# EAGLE design 6lipo (EAGLE 5.11)
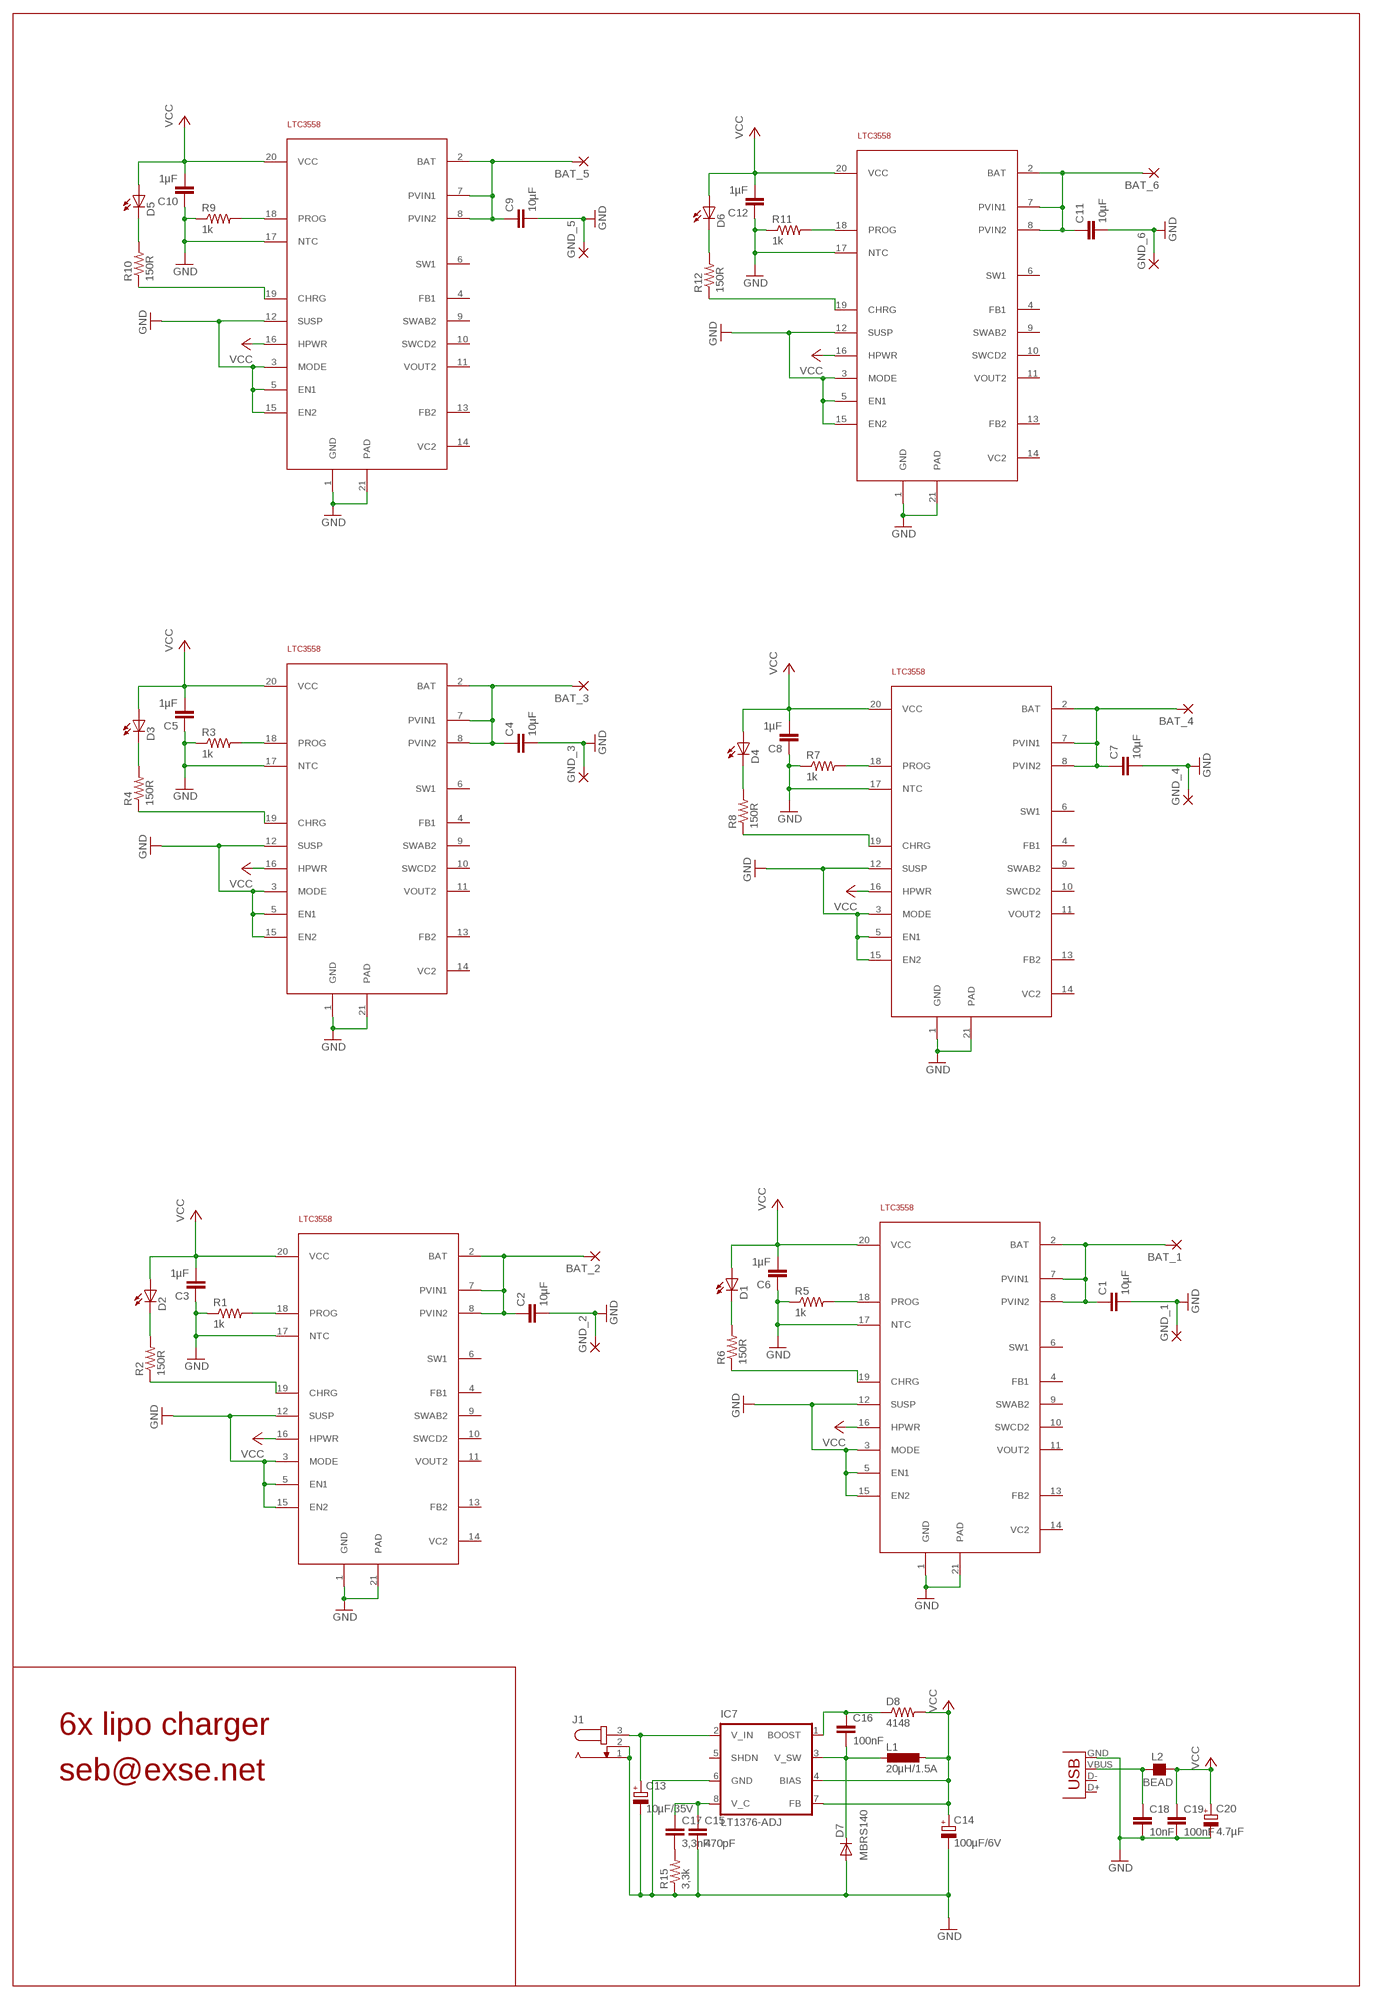
[diagram p0: schematic, sheet 1]

## Parts
BAT_1  SMD5  [SMD2,54-5,08]
BAT_2  SMD5  [SMD2,54-5,08]
BAT_3  SMD5  [SMD2,54-5,08]
BAT_4  SMD5  [SMD2,54-5,08]
BAT_5  SMD5  [SMD2,54-5,08]
BAT_6  SMD5  [SMD2,54-5,08]
C1  10µF  CAP0805  [0805]
C2  10µF  CAP0805  [0805]
C3  1µF  CAP0805  [0805]
C4  10µF  CAP0805  [0805]
C5  1µF  CAP0805  [0805]
C6  1µF  CAP0805  [0805]
C7  10µF  CAP0805  [0805]
C8  1µF  CAP0805  [0805]
C9  10µF  CAP0805  [0805]
C10  1µF  CAP0805  [0805]
C11  10µF  CAP0805  [0805]
C12  1µF  CAP0805  [0805]
C13  10µF/35V  CPOL-EUSMCD  [SMC_D]
C14  100µF/6V  CPOL-EUSMCD  [SMC_D]
C15  470pF  CAP0805  [0805]
C16  100nF  CAP0805  [0805]
C17  3,3nF  CAP0805  [0805]
C18  10nF  CAP0805  [0805]
C19  100nF  CAP0805  [0805]
C20  4.7µF  CPOL-EUSMCC  [SMC_C]
D1  LEDCHIPLED_0805  [CHIPLED_0805]
D2  LEDCHIPLED_0805  [CHIPLED_0805]
D3  LEDCHIPLED_0805  [CHIPLED_0805]
D4  LEDCHIPLED_0805  [CHIPLED_0805]
D5  LEDCHIPLED_0805  [CHIPLED_0805]
D6  LEDCHIPLED_0805  [CHIPLED_0805]
D7  MBRS140  DIODE-SMB  [SMB]
D8  4148  RESISTOR1206  [1206]
GND_1  SMD5  [SMD2,54-5,08]
GND_2  SMD5  [SMD2,54-5,08]
GND_3  SMD5  [SMD2,54-5,08]
GND_4  SMD5  [SMD2,54-5,08]
GND_5  SMD5  [SMD2,54-5,08]
GND_6  SMD5  [SMD2,54-5,08]
IC1  LTC3558  [UD-QFN20]
IC2  LTC3558  [UD-QFN20]
IC3  LTC3558  [UD-QFN20]
IC4  LTC3558  [UD-QFN20]
IC5  LTC3558  [UD-QFN20]
IC6  LTC3558  [UD-QFN20]
IC7  LT1376-ADJ  LT1376  [SO-08]
J1  JACK-PLUG0  [SPC4077]
L1  20µH/1.5A  DO3316P  [DO3316P]
L2  BEAD  FB_0805  [L0805]
R1  1k  RESISTOR  [0805]
R2  150R  RESISTOR  [0805]
R3  1k  RESISTOR  [0805]
R4  150R  RESISTOR  [0805]
R5  1k  RESISTOR  [0805]
R6  150R  RESISTOR  [0805]
R7  1k  RESISTOR  [0805]
R8  150R  RESISTOR  [0805]
R9  1k  RESISTOR  [0805]
R10  150R  RESISTOR  [0805]
R11  1k  RESISTOR  [0805]
R12  150R  RESISTOR  [0805]
R15  3,3k  RESISTOR  [0805]
X1  USB-SMD-NS  [USB-MINIB-NOSTOP]

## Nets
GND: C1.2 C2.2 C3.1 C4.2 C5.1 C6.1 C7.2 C8.1 C9.2 C10.1 C11.2 C12.1 C13.- C14.- C15.2 C18.2 C19.2 C20.- D7.A GND_1.1(P) GND_2.1(P) GND_3.1(P) GND_4.1(P) GND_5.1(P) GND_6.1(P) IC1.1(GND) IC1.3(MODE) IC1.5(EN1) IC1.12(SUSP) IC1.15(EN2) IC1.17(NTC) IC1.21(PAD) IC2.1(GND) IC2.3(MODE) IC2.5(EN1) IC2.12(SUSP) IC2.15(EN2) IC2.17(NTC) IC2.21(PAD) IC3.1(GND) IC3.3(MODE) IC3.5(EN1) IC3.12(SUSP) IC3.15(EN2) IC3.17(NTC) IC3.21(PAD) IC4.1(GND) IC4.3(MODE) IC4.5(EN1) IC4.12(SUSP) IC4.15(EN2) IC4.17(NTC) IC4.21(PAD) IC5.1(GND) IC5.3(MODE) IC5.5(EN1) IC5.12(SUSP) IC5.15(EN2) IC5.17(NTC) IC5.21(PAD) IC6.1(GND) IC6.3(MODE) IC6.5(EN1) IC6.12(SUSP) IC6.15(EN2) IC6.17(NTC) IC6.21(PAD) IC7.6(GND) J1.1 J1.2 R1.1 R3.1 R5.1 R7.1 R9.1 R11.1 R15.1 X1.GND
N$1: BAT_1.1(P) C1.1 IC1.2(BAT) IC1.7(PVIN1) IC1.8(PVIN2)
N$2: D1.C R6.2
N$3: IC1.18(PROG) R5.2
N$4: IC2.18(PROG) R1.2
N$5: IC2.19(CHRG) R2.1
N$6: D2.C R2.2
N$7: BAT_2.1(P) C2.1 IC2.2(BAT) IC2.7(PVIN1) IC2.8(PVIN2)
N$8: IC3.18(PROG) R3.2
N$9: IC3.19(CHRG) R4.1
N$10: IC1.19(CHRG) R6.1
N$11: D3.C R4.2
N$12: BAT_3.1(P) C4.1 IC3.2(BAT) IC3.7(PVIN1) IC3.8(PVIN2)
N$13: IC4.18(PROG) R7.2
N$14: IC4.19(CHRG) R8.1
N$15: D4.C R8.2
N$16: BAT_4.1(P) C7.1 IC4.2(BAT) IC4.7(PVIN1) IC4.8(PVIN2)
N$17: IC5.18(PROG) R9.2
N$18: IC5.19(CHRG) R10.1
N$19: D5.C R10.2
N$20: BAT_5.1(P) C9.1 IC5.2(BAT) IC5.7(PVIN1) IC5.8(PVIN2)
N$21: IC6.18(PROG) R11.2
N$22: IC6.19(CHRG) R12.1
N$23: D6.C R12.2
N$24: BAT_6.1(P) C11.1 IC6.2(BAT) IC6.7(PVIN1) IC6.8(PVIN2)
N$26: C17.2 R15.2
N$27: C13.+ IC7.2(V_IN) J1.3
N$30: C18.1 L2.1 X1.VBUS
N$56: C15.1 C17.1 IC7.8(V_C)
N$57: C16.2 D7.C IC7.3(V_SW) L1.1
N$58: C16.1 D8.1 IC7.1(BOOST)
VCC: C3.2 C5.2 C6.2 C8.2 C10.2 C12.2 C14.+ C19.1 C20.+ D1.A D2.A D3.A D4.A D5.A D6.A D8.2 IC1.16(HPWR) IC1.20(VCC) IC2.16(HPWR) IC2.20(VCC) IC3.16(HPWR) IC3.20(VCC) IC4.16(HPWR) IC4.20(VCC) IC5.16(HPWR) IC5.20(VCC) IC6.16(HPWR) IC6.20(VCC) IC7.4(BIAS) IC7.7(FB) L1.2 L2.2
Unconnected: IC1.4(FB1) IC1.6(SW1) IC1.9(SWAB2) IC1.10(SWCD2) IC1.11(VOUT2) IC1.13(FB2) IC1.14(VC2) IC2.4(FB1) IC2.6(SW1) IC2.9(SWAB2) IC2.10(SWCD2) IC2.11(VOUT2) IC2.13(FB2) IC2.14(VC2) IC3.4(FB1) IC3.6(SW1) IC3.9(SWAB2) IC3.10(SWCD2) IC3.11(VOUT2) IC3.13(FB2) IC3.14(VC2) IC4.4(FB1) IC4.6(SW1) IC4.9(SWAB2) IC4.10(SWCD2) IC4.11(VOUT2) IC4.13(FB2) IC4.14(VC2) IC5.4(FB1) IC5.6(SW1) IC5.9(SWAB2) IC5.10(SWCD2) IC5.11(VOUT2) IC5.13(FB2) IC5.14(VC2) IC6.4(FB1) IC6.6(SW1) IC6.9(SWAB2) IC6.10(SWCD2) IC6.11(VOUT2) IC6.13(FB2) IC6.14(VC2) IC7.5(SHDN) X1.D+ X1.D-

## Notes on the sheet
- 6x lipo charger
- seb@exse.net

## Library data of the parts
BAT_1-BAT_6 GND_1-GND_6 = wirepad:SMD5: SMD PAD
C1-C12 C15-C19 = SparkFun:CAP: Capacitor Standard 0603 ceramic capacitor, and 0.1" leaded capacitor.
C13 C14 C20 = resistor:CPOL-EU: POLARIZED CAPACITOR, European symbol
D1-D6 = led:LED: LED OSRAM: - CHIPLED LG R971, LG N971, LY N971, LG Q971, LY Q971, LO R971, LY R971 LH N974, LH R974 LS Q976, LO Q976, LY Q976 LO Q996 - Hyper CHIPLED LW Q18S LB Q993, LB Q99A, LB R99A - SideLED LS A670, LO A670, LY A670, LG A670, LP A670 LB A673, LV A673, LT A673, LW A673 LH A674 LY A675 LS A676, LA A676, LO A676, LY A676, LW A676 LS A679, LY A679, LG A679 - Hyper Micro SIDELED® LS Y876, LA Y876, LO Y876, LY Y876 LT Y87S - SmartLED LW L88C, LW L88S LB L89C, LB L89S, LG L890 LS L89K, LO L89K, LY L89K LS L896, LA L896, LO L896, LY L896 - TOPLED LS T670, LO T670, LY T670, LG T670, LP T670 LSG T670, LSP T670, LSY T670, LOP T670, LYG T670 LG T671, LOG T671, LSG T671 LB T673, LV T673, LT T673, LW T673 LH T674 LS T676, LA T676, LO T676, LY T676, LB T676, LH T676, LSB T676, LW T676 LB T67C, LV T67C, LT T67C, LS T67K, LO T67K, LY T67K, LW E67C LS E67B, LA E67B, LO E67B, LY E67B, LB E67C, LV E67C, LT E67C LW T67C LS T679, LY T679, LG T679 LS T770, LO T770, LY T770, LG T770, LP T770 LB T773, LV T773, LT T773, LW T773 LH T774 LS E675, LA E675, LY E675, LS T675 LS T776, LA T776, LO T776, LY T776, LB T776 LHGB T686 LT T68C, LB T68C - Hyper Mini TOPLED® LB M676 - Mini TOPLED Santana® LG M470 LS M47K, LO M47K, LY M47K Source: http://www.osram.convergy.de LUXEON: - LUMILED® LXK2-PW12-R00, LXK2-PW12-S00, LXK2-PW14-U00, LXK2-PW14-V00 LXK2-PM12-R00, LXK2-PM12-S00, LXK2-PM14-U00 LXK2-PE12-Q00, LXK2-PE12-R00, LXK2-PE12-S00, LXK2-PE14-T00, LXK2-PE14-U00 LXK2-PB12-K00, LXK2-PB12-L00, LXK2-PB12-M00, LXK2-PB14-N00, LXK2-PB14-P00, LXK2-PB14-Q00 LXK2-PR12-L00, LXK2-PR12-M00, LXK2-PR14-Q00, LXK2-PR14-R00 LXK2-PD12-Q00, LXK2-PD12-R00, LXK2-PD12-S00 LXK2-PH12-R00, LXK2-PH12-S00 LXK2-PL12-P00, LXK2-PL12-Q00, LXK2-PL12-R00 Source: www.luxeon.com KINGBRIGHT: KA-3528ASYC Source: www.kingbright.com
D7 = diode:DIODE-: DIODE
D8 R1-R12 R15 = SparkFun:RESISTOR: Resistor Basic schematic elements and footprints for 0603, 1206, and PTH 1/10th watt (small) resistors.
IC1-IC6 = seb:LTC3558
IC7 = v-reg:LT1376
J1 = con-jack:JACK-PLUG: DC POWER JACK Power Jack, DC, Right Angle, Through Hole, Rated 5A at 16VDC, PC Terminals Distributor: Farnell (www.Farnell.de) Drawing: 84N1161.pdf / 84N1162.pdf Manufacturer: SPC Technology (www.spctechnology.com) Type: SPC4077 / SPC 4078
L1 = inductor-coilcraft:DO3316P: COILCRAFT; OC_FARNELL: unknown; OC_NEWARK: unknown
L2 = rc-master-smd:FB_: FERRITE BEAD
X1 = SparkFun:USB: USB Connectors USB-B-PTH is fully proven SKU : PRT-00139 USB-miniB is fully proven SKU : PRT-00587 USB-A-PCB is untested. USB-A-H is throughly reviewed, but untested. Spark Fun Electronics SKU : PRT-00437 USB-B-SMT is throughly reviewed, but untested. Needs silkscreen touching up. USB-A-S has not been used/tested USB-MB-H has not been used/tested

## Board
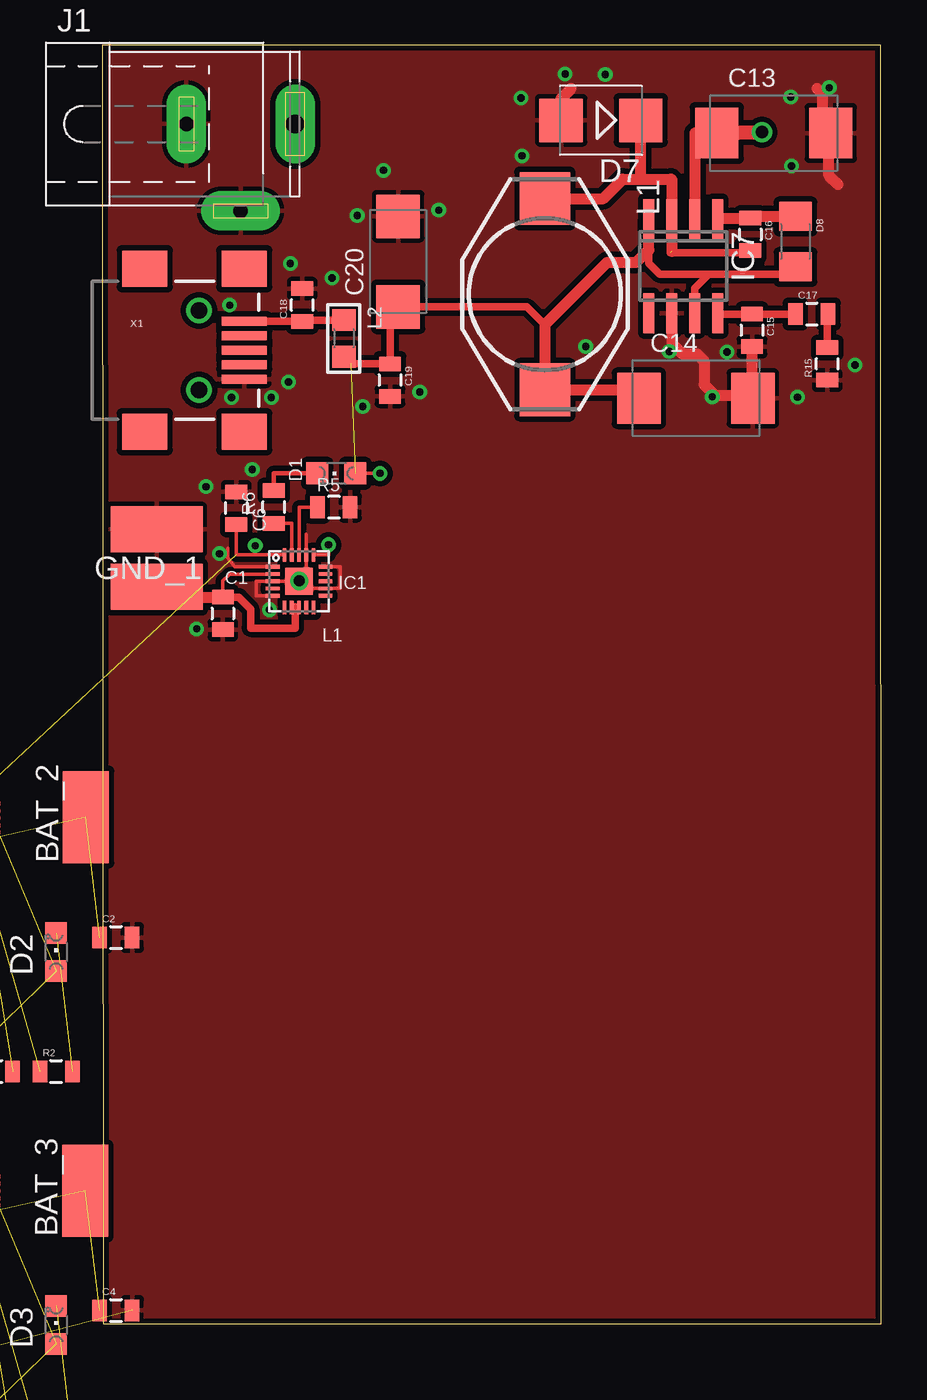
[diagram p1: board, top side]
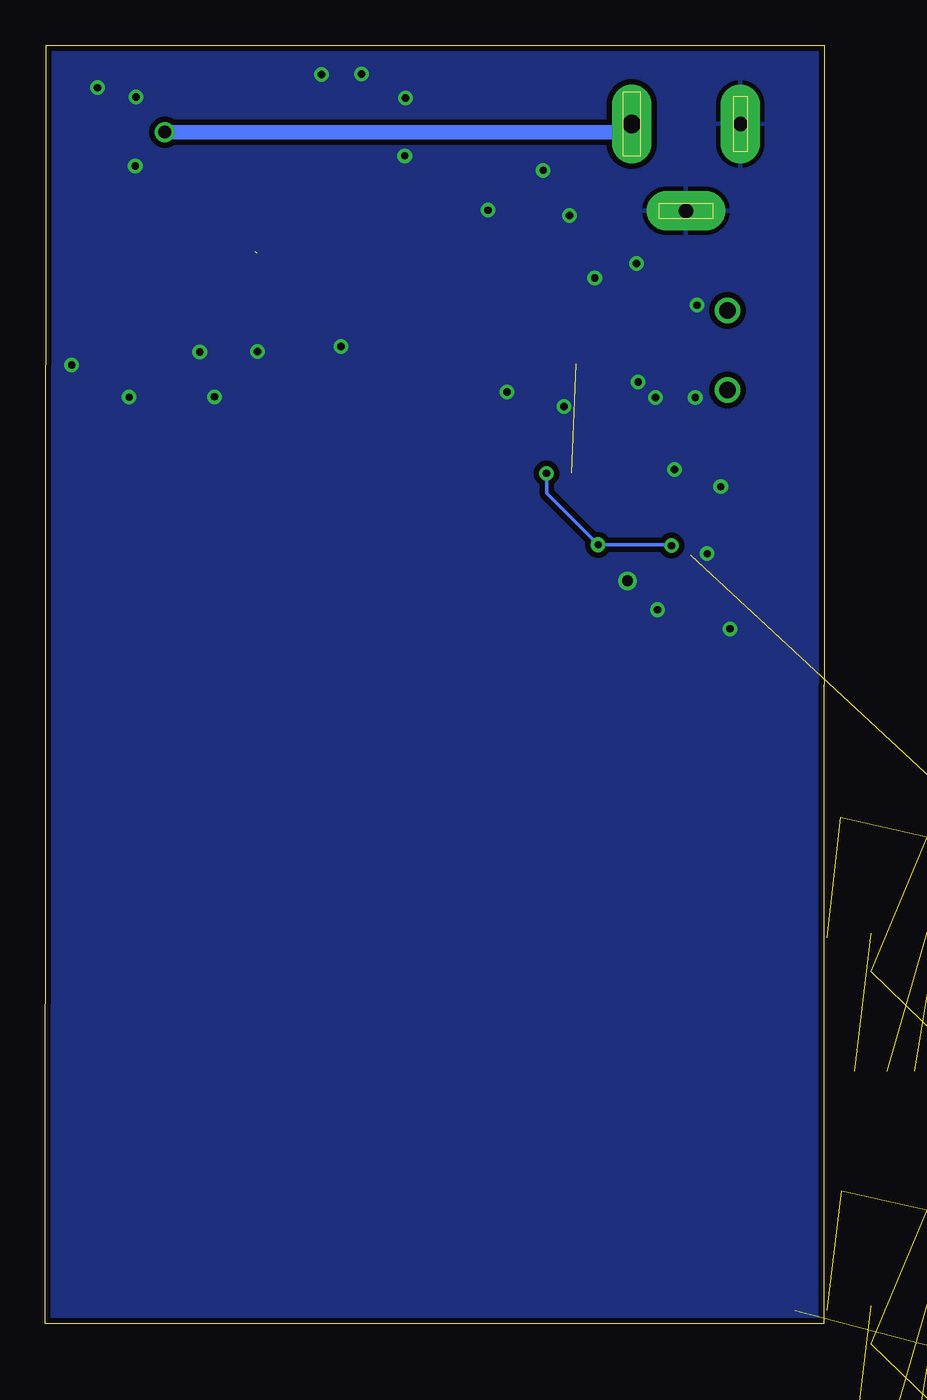
[diagram p2: board, bottom side, seen from below]

Size 43.05 x 70.65 mm. Coordinates in mm from the lower left corner, seen from the top.
Outline: 0.05,0 43.05,0 43,70.65 0,70.65 0.05,0
Copper layers (1*16): Top 0.035mm / dielectric 1.5mm / Bottom 0.035mm
Design rules "default *": minimum track width 0.2mm, minimum drill 0.3mm, track to track 0.2mm, track to pad 0.2mm, pad to pad 0.2mm, via to via 0.2mm, smd to smd 0.2mm, copper to edge 0.2mm, drill to drill 0.2mm, minimum pad ring 10mil, minimum via ring 8mil, stop-mask expansion 4mil, vias tented up to drill 100mil, thermal gap 10mil

### Footprints (pad centres in the part's own frame; a part is rotated, then mirrored left to right if it is on the bottom)
SMD2,54-5,08 = smd 2.54 x 5.08: 1 0,0
0805 = smd 0.8 x 1.2: 1 -0.9,0; 2 0.9,0
SMC_D = smd 2.4 x 2.8: + -3.15,0; - 3.15,0
SMC_C = smd 2.4 x 2.4: + -2.5,0; - 2.5,0
CHIPLED_0805 = smd 1.2 x 1.2: A 0,-1.05; C 0,1.05
SMB = smd 2.4 x 2.4: A 2.2,0; C -2.2,0
1206 = smd 1.6 x 1.8: 1 -1.4,0; 2 1.4,0
UD-QFN20 = smd 0.751 x 0.2: 1 -1.451,0.8; 2 -1.451,0.4; 3 -1.451,0; 4 -1.451,-0.4; 5 -1.451,-0.8; 11 1.451,-0.8; 12 1.451,-0.4; 13 1.451,0; 14 1.451,0.4; 15 1.451,0.8 | smd 0.2 x 0.751: 6 -0.8,-1.451; 7 -0.4,-1.451; 8 0,-1.451; 9 0.4,-1.451; 10 0.8,-1.451; 16 0.8,1.451; 17 0.4,1.451; 18 0,1.451; 19 -0.4,1.451; 20 -0.8,1.451 | smd 1.5 x 1.5: 21 0,0
SO-08 = smd 0.6 x 2.2: 1 -1.905,-2.6; 2 -0.635,-2.6; 3 0.635,-2.6; 4 1.905,-2.6; 5 1.905,2.6; 6 0.635,2.6; 7 -0.635,2.6; 8 -1.905,2.6
SPC4077 = drill 0.8 pad 2.184 long: 1 -3,0; 2 0,-4.8 | drill 1 pad 2.184 long: 3 3,0
DO3316P = smd 2.92 x 2.79: 1 -5.28,0; 2 5.28,0
L0805 = smd 1.2 x 1.3: 1 -1.016,0; 2 1.016,0
USB-MINIB-NOSTOP = smd 2.5 x 0.5: D+ 2.5,0; D- 2.5,0.8; GND 2.5,-1.6; ID 2.5,-0.8; VBUS 2.5,1.6 | smd 2.5 x 2: G1 -3,-4.5; G2 -3,4.5; G3 2.5,4.5; G4 2.5,-4.5 | drill 0.9 pad 0.8 round: H1 0,2.2 | drill 0.9 pad 0.787 round: H2 0,-2.2

### Placement (x,y rotation side)
BAT_1  3.01,40.73 90 top
BAT_2  -0.9,28 0 top
BAT_3  -0.95,7.35 0 top
BAT_4  -0.95,-12.65 0 top  (outside the outline)
BAT_5  -0.95,-32.75 0 top  (outside the outline)
BAT_6  -0.95,-52.8 0 top  (outside the outline)
C1  6.66,39.26 270 top
C2  0.75,21.35 0 top
C3  -9.15,13.95 0 top  (outside the outline)
C4  0.75,0.75 0 top
C5  -9.15,-6.6 0 top  (outside the outline)
C6  7.4,45.08 270 top
C7  0.75,-19.25 0 top  (outside the outline)
C8  -9.15,-26.65 0 top  (outside the outline)
C9  0.75,-39.3 0 top  (outside the outline)
C10  -9.15,-46.7 0 top  (outside the outline)
C11  0.75,-59.35 0 top  (outside the outline)
C12  -9.15,-66.7 0 top  (outside the outline)
C13  37.1,65.8 0 top
C14  32.8,51.15 0 top
C15  35.9,54.9 270 top
C16  35.8,60.2 270 top
C17  39.2,55.8 0 top
C18  11.05,56.3 90 top
C19  15.9,52.15 270 top
C20  16.35,58.7 90 top
D1  12.93,47 90 top
D2  -2.55,20.55 0 top
D3  -2.55,-0.05 0 top
D4  -2.55,-20.05 0 top  (outside the outline)
D5  -2.55,-40.1 0 top  (outside the outline)
D6  -2.55,-60.15 0 top  (outside the outline)
D7  27.55,66.5 180 top
D8  38.3,59.8 270 top
GND_1  3,43.9 90 top
GND_2  -7.5,18.9 0 top  (outside the outline)
GND_3  -7.5,-1.65 0 top  (outside the outline)
GND_4  -7.5,-21.7 0 top  (outside the outline)
GND_5  -7.5,-41.75 0 top  (outside the outline)
GND_6  -7.5,-61.8 0 top  (outside the outline)
IC1  10.87,41.04 0 top
IC2  -7.5,27.95 0 top  (outside the outline)
IC3  -7.5,7.35 0 top  (outside the outline)
IC4  -7.5,-12.65 0 top  (outside the outline)
IC5  -7.5,-32.7 0 top  (outside the outline)
IC6  -7.5,-52.75 0 top  (outside the outline)
IC7  32.1,58.45 180 top
J1  7.65,66.3 0 top
L1  24.45,56.9 270 top
L2  13.35,54.45 270 top
R1  -5.85,13.95 0 top  (outside the outline)
R2  -2.55,13.95 0 top
R3  -5.85,-6.6 0 top  (outside the outline)
R4  -2.55,-6.6 0 top  (outside the outline)
R5  12.79,45.13 180 top
R6  9.47,45.14 90 top
R7  -5.85,-26.65 0 top  (outside the outline)
R8  -2.55,-26.65 0 top  (outside the outline)
R9  -5.85,-46.7 0 top  (outside the outline)
R10  -2.55,-46.7 0 top  (outside the outline)
R11  -5.85,-66.75 0 top  (outside the outline)
R12  -2.55,-66.75 0 top  (outside the outline)
R15  40.05,53.05 90 top
X1  5.35,53.8 0 top

### Tracks (layer width: path | path; a pad name or v marks a point on that pad's centre or on a via)
GND  (via drill 0.4 pad 0.3, 0.6 pad 0.3)  (53 unrouted)
  Top 0.2: IC1.1 7.31,41.84 6.92,42.33 | 6.92,42.33 6.92,42.86 | IC1.21 IC1.3 8.5,41.04 8.5,40.24 IC1.5 | 10.37,40.64 IC1.12 13.15,40.64 13.15,41.84 IC1.15 | 6.92,42.33 6.69,42.56 v6.48,42.56
  Top 0.203: IC1.21 11.27,41.34 IC1.17 11.27,43.63
  Top 0.254: IC1.21 10.37,40.64
  Top 0.61: C15.2 35.9,51.2 C14.- 35.8,51.3 33.85,51.3 33.25,51.9 33.25,53.2 32.85,53.6 32.05,53.6 31.46,54.19 IC7.6 | 40.65,62.95 40.15,63.45 40.15,65.7 C13.- 39.8,66.25 39.8,67.95 39.5,68.25 | D7.A 25.35,67.7 25.9,68.25
  other vias: 40.17,68.31 10.88,41.05 25.58,69.06 33.7,51.23 31.32,53.74 8.29,47.21 38.08,63.98 7.04,56.29 23.19,64.54 26.72,54.01 5.22,38.41 38.42,51.21 34.52,53.71 9.23,39.46 5.73,46.26 23.14,67.74 27.79,69.04 38.04,67.79 41.59,52.99 14.09,61.24 15.54,63.74 18.59,61.54 17.54,51.49 14.39,50.69 12.69,57.79 10.39,58.59 10.29,52.04 7.14,51.19 9.34,51.19
  pour Top (isolate 0.3): 0.05,70.85 43.05,70.85 43.05,-1 0.05,-1
  pour Bottom (isolate 0.3): -0.05,70.75 0.05,-1 43.05,-1 42.95,70.75
N$1
  Top 0.2: IC1.7 10.65,39.64 IC1.8 | IC1.2 7.04,41.44 6.66,41.06 C1.1
  Top 0.254: C1.1 7.08,40.16
  Top 0.406: 10.65,39.64 10.65,38.45 8.2,38.45 8.2,39.5 7.54,40.16 C1.1
  Top 0.61: C1.1 4.72,40.16 3.38,40.16 BAT_1.1
  Top 0.813: 4.8,41.28 4.8,40.16 4.72,40.16
N$2
  Top 0.254: R6.2 9.48,47 D1.C
N$3
  Top 0.2: IC1.18 10.87,45.13 R5.2
N$4  (1 unrouted)
N$5  (1 unrouted)
N$6  (1 unrouted)
N$7  (4 unrouted)
N$8  (1 unrouted)
N$9  (1 unrouted)
N$10
  Top 0.2: IC1.19 10.47,44.24 R6.1
N$11  (1 unrouted)
N$12  (4 unrouted)
N$13  (1 unrouted)
N$14  (1 unrouted)
N$15  (1 unrouted)
N$16  (4 unrouted)
N$17  (1 unrouted)
N$18  (1 unrouted)
N$19  (1 unrouted)
N$20  (4 unrouted)
N$21  (1 unrouted)
N$22  (1 unrouted)
N$23  (1 unrouted)
N$24  (4 unrouted)
N$26
  Top 0.406: C17.2 40.05,55.75 R15.2
N$27  (via drill 0.7)
  Top 0.61: IC7.2 32.73,65.8 C13.+
  Top 0.813: v36.45,65.85 C13.+
  Bottom 0.813: J1.3 11.15,65.85 v36.45,65.85
N$30
  Top 0.406: X1.VBUS C18.1 11.12,55.47 L2.1
N$56
  Top 0.406: IC7.8 34.05,55.8 C15.1 C17.1
N$57  (1 unrouted)
  Top 0.406: C16.2 35.67,59.17 31.38,59.17
  Top 0.61: 31.46,59.27 IC7.3 31.46,63.2 31.41,63.25 29.65,63.25 | L1.1 27.68,62.18 28.75,63.25 29.65,63.25 | D7.C 29.75,63.35 29.65,63.25
N$58
  Top 0.61: IC7.1 34.05,61.1 C16.1 35.9,61.2 D8.1
VCC  (via drill 0.4)  (21 unrouted)
  Top 0.2: 8.4,42.49 7.4,42.49 C6.2 | 8.4,42.49 IC1.20 | IC1.16 12.5,42.49 v12.5,43.05 | v8.45,43 8.4,43 8.4,42.49 | v15.35,47 D1.A
  Top 0.406: D8.2 37.9,58 33.5,58 | 33.5,58 32.73,57.23 IC7.7 | 30.2,59.34 30.2,58.6 30.8,58 33.5,58 | L2.2 13.73,53.05 C19.1 15.9,55.75 C20.+ 23.45,56.2 24.45,55.2
  Top 0.61: IC7.4 30.2,59.34 29.5,58.65 27.9,58.65 24.45,55.2 L1.2 29.18,51.62 C14.+
  Bottom 0.2: v8.45,43 8.45,43.05 v12.5,43.05 15.35,45.9 v15.35,47

### Text on the board
tNames: L1
tDocu: OFF_SW | ON_SW | GND | Vin | GND | Vbat | GND | Vout